# EAGLE design Logoi (EAGLE 9.6.2)
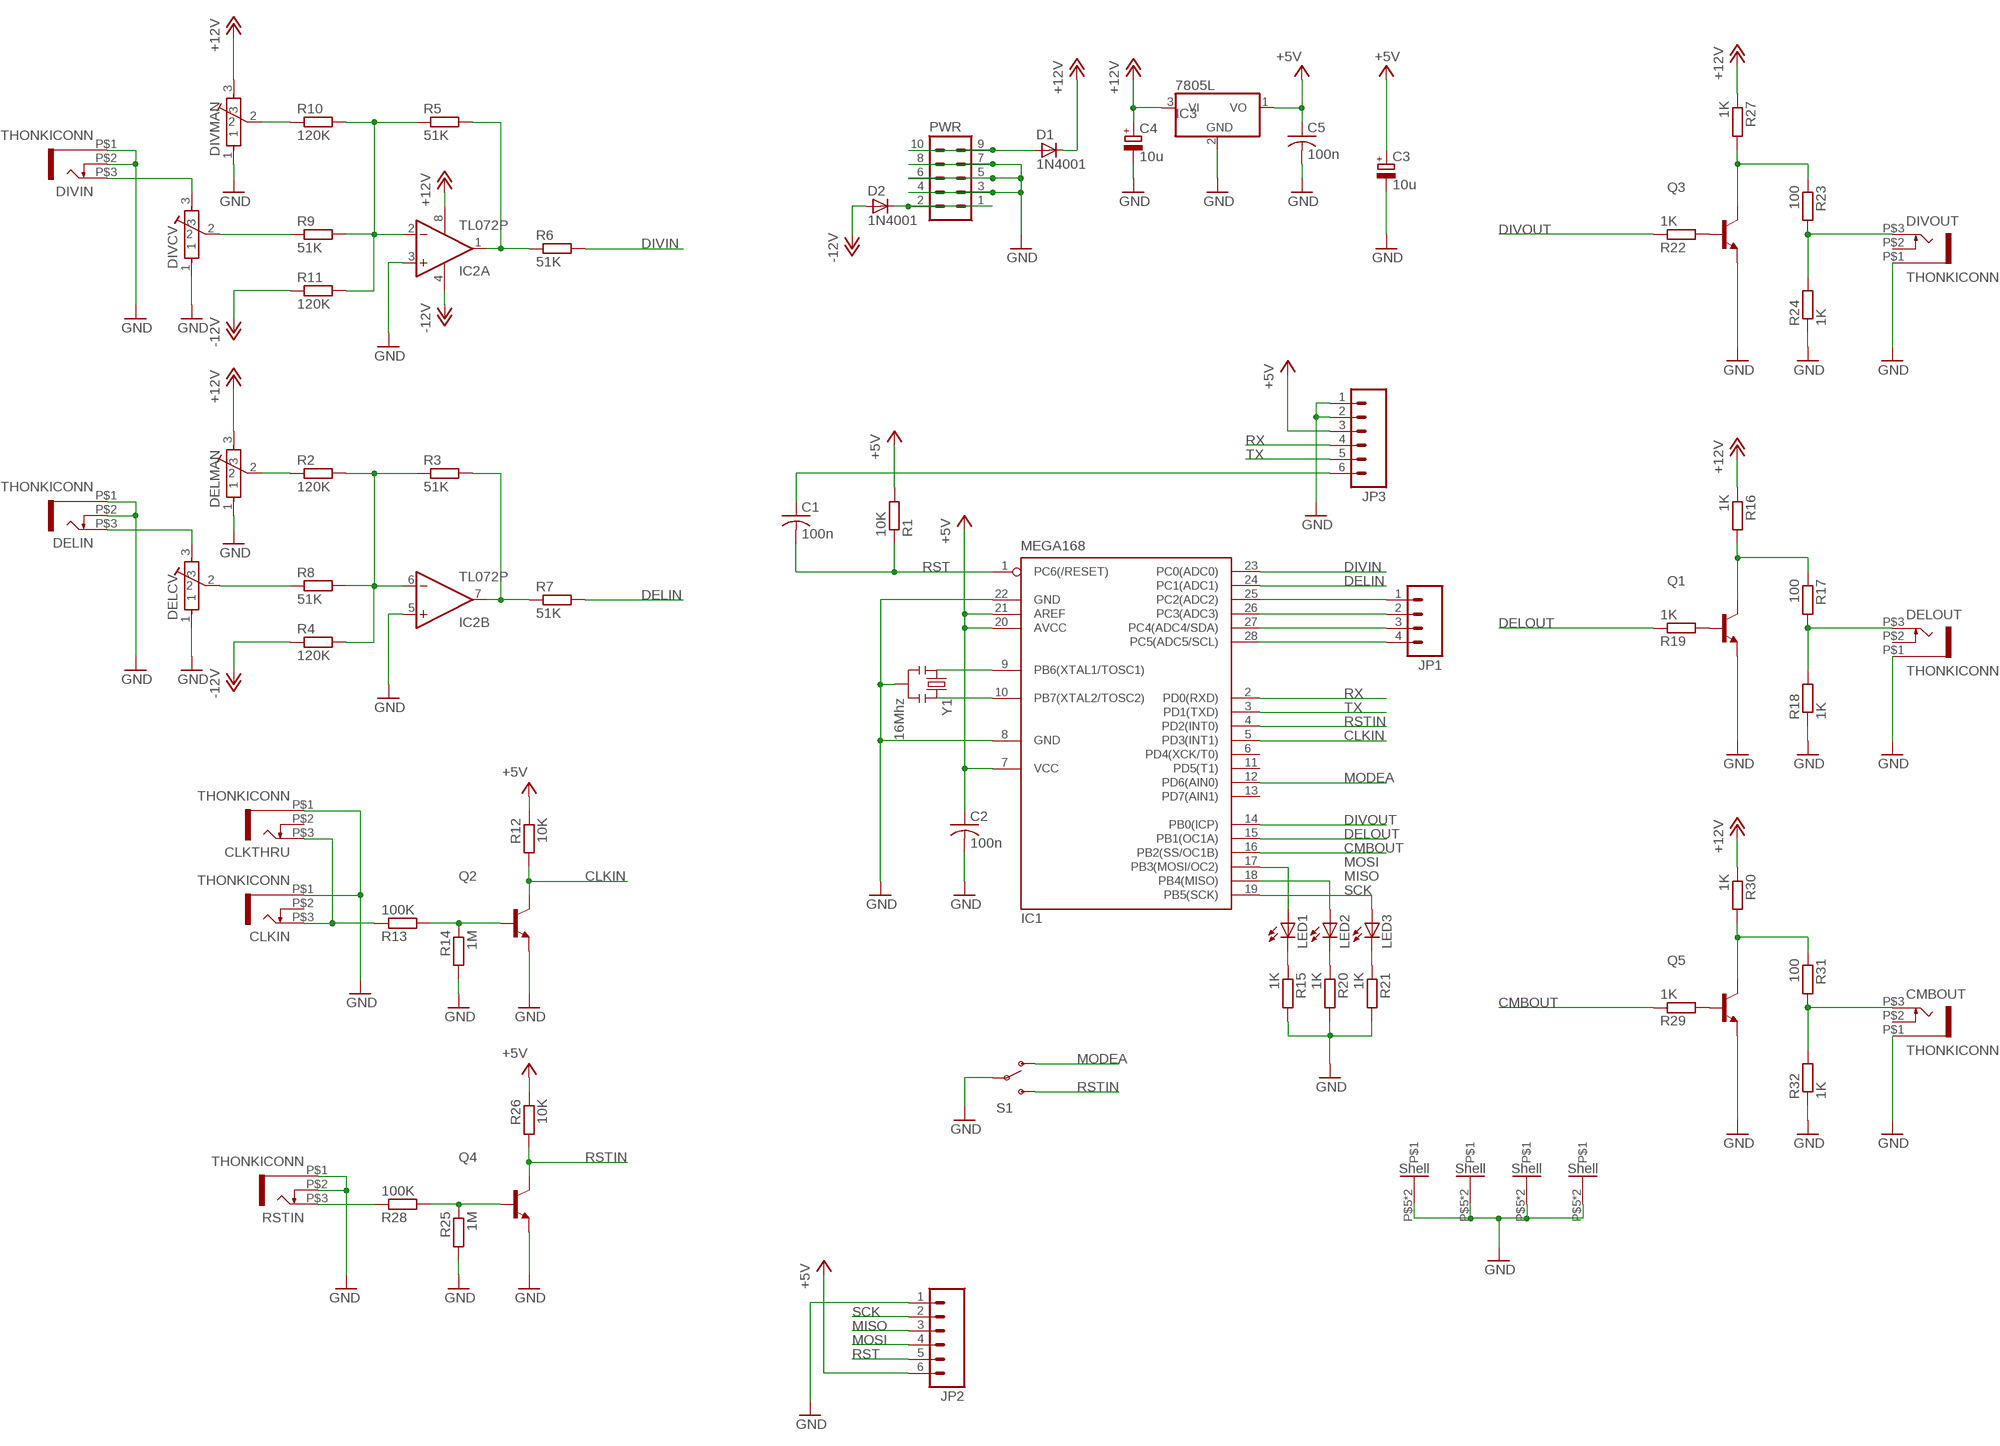
[diagram p0: schematic, sheet 1]

## Parts
C1  100n  C-US050-024X044  [C050-024X044]
C2  100n  C-US050-024X044  [C050-024X044]
C3  10u  CPOL-EUE5-6  [E5-6]
C4  10u  CPOL-EUE5-6  [E5-6]
C5  100n  C-US050-024X044  [C050-024X044]
CLKIN  THONKICONN  [THONKICONN]
CLKTHRU  THONKICONN  [THONKICONN]
CMBOUT  THONKICONN  [THONKICONN]
D1  1N4001  DIODE1N4001  [DIODE-1N4001]
D2  1N4001  DIODE1N4001  [DIODE-1N4001]
DELCV  POT-ALPS-RK09L1140  [POT-ALPS-RK09L1140]
DELIN  THONKICONN  [THONKICONN]
DELMAN  POT-ALPS-RK09L1140  [POT-ALPS-RK09L1140]
DELOUT  THONKICONN  [THONKICONN]
DIVCV  POT-ALPS-RK09L1140  [POT-ALPS-RK09L1140]
DIVIN  THONKICONN  [THONKICONN]
DIVMAN  POT-ALPS-RK09L1140  [POT-ALPS-RK09L1140]
DIVOUT  THONKICONN  [THONKICONN]
IC1  MEGA168  MEGA8-P  [DIL28-3]
IC2  TL072P  [DIL08]
IC3  7805L  [TO92]
JP1  M04PTH  [1X04]
JP2  M06SIP  [1X06]
JP3  M06SIP  [1X06]
LED1  LED3MM  [LED3MM]
LED2  LED3MM  [LED3MM]
LED3  LED3MM  [LED3MM]
PWR  MA05-2  [MA05-2]
Q1  2N3904-NPN-TO92-EBC  [TO92-EBC]
Q2  2N3904-NPN-TO92-EBC  [TO92-EBC]
Q3  2N3904-NPN-TO92-EBC  [TO92-EBC]
Q4  2N3904-NPN-TO92-EBC  [TO92-EBC]
Q5  2N3904-NPN-TO92-EBC  [TO92-EBC]
R1  10K  R-EU_0204/7  [0204/7]
R2  120K  R-EU_0204/7  [0204/7]
R3  51K  R-EU_0204/7  [0204/7]
R4  120K  R-EU_0204/7  [0204/7]
R5  51K  R-EU_0204/7  [0204/7]
R6  51K  R-EU_0204/7  [0204/7]
R7  51K  R-EU_0204/7  [0204/7]
R8  51K  R-EU_0204/7  [0204/7]
R9  51K  R-EU_0204/7  [0204/7]
R10  120K  R-EU_0204/7  [0204/7]
R11  120K  R-EU_0204/7  [0204/7]
R12  10K  R-EU_0204/7  [0204/7]
R13  100K  R-EU_0204/7  [0204/7]
R14  1M  R-EU_0204/7  [0204/7]
R15  1K  R-EU_0204/7  [0204/7]
R16  1K  R-EU_0204/7  [0204/7]
R17  100  R-EU_0204/7  [0204/7]
R18  1K  R-EU_0204/7  [0204/7]
R19  1K  R-EU_0204/7  [0204/7]
R20  1K  R-EU_0204/7  [0204/7]
R21  1K  R-EU_0204/7  [0204/7]
R22  1K  R-EU_0204/7  [0204/7]
R23  100  R-EU_0204/7  [0204/7]
R24  1K  R-EU_0204/7  [0204/7]
R25  1M  R-EU_0204/7  [0204/7]
R26  10K  R-EU_0204/7  [0204/7]
R27  1K  R-EU_0204/7  [0204/7]
R28  100K  R-EU_0204/7  [0204/7]
R29  1K  R-EU_0204/7  [0204/7]
R30  1K  R-EU_0204/7  [0204/7]
R31  100  R-EU_0204/7  [0204/7]
R32  1K  R-EU_0204/7  [0204/7]
RSTIN  THONKICONN  [THONKICONN]
S1  SWITCH-SPST  [SWITCH-SPDT-SALECOM-T8014]
Y1  16Mhz  RESONATORPTH  [RESONATOR-PTH]

## Nets
+5V: C2.1 C3.+ C5.1 IC1.7(VCC) IC1.20(AVCC) IC1.21(AREF) IC3.1(VO) JP2.6 JP3.3 R1.2 R12.1 R26.1
+12V: C4.+ D1.C DELMAN.3 DIVMAN.3 IC2.8(P:V+) IC3.3(VI) R16.1 R27.1 R30.1
-12V: D2.A IC2.4(P:V-) R4.1 R11.1
CLKIN: IC1.5(PD3(INT1)) Q2.C R12.2
CMBOUT: IC1.16(PB2(SS/OC1B)) R29.1
DELIN: IC1.24(PC1(ADC1)) R7.2
DELOUT: IC1.15(PB1(OC1A)) R19.1
DIVIN: IC1.23(PC0(ADC0)) R6.2
DIVOUT: IC1.14(PB0(ICP)) R22.1
GND: C2.2 C3.- C4.- C5.2 CLKIN.P$1 CLKTHRU.P$1 CMBOUT.P$1 DELCV.1 DELCV.P$5 DELCV.P$6 DELIN.P$1 DELIN.P$2 DELMAN.1 DELMAN.P$5 DELMAN.P$6 DELOUT.P$1 DIVCV.1 DIVCV.P$5 DIVCV.P$6 DIVIN.P$1 DIVIN.P$2 DIVMAN.1 DIVMAN.P$5 DIVMAN.P$6 DIVOUT.P$1 IC1.8(GND) IC1.22(GND) IC2.3(A:+IN) IC2.5(B:+IN) IC3.2(GND) JP2.1 JP3.1 JP3.2 PWR.3 PWR.4 PWR.5 PWR.6 PWR.7 PWR.8 Q1.E Q2.E Q3.E Q4.E Q5.E R14.2 R15.2 R18.1 R20.2 R21.2 R24.1 R25.2 R32.1 RSTIN.P$1 RSTIN.P$2 S1.2(P) Y1.2
MISO: IC1.18(PB4(MISO)) JP2.3 LED2.A
MODEA: IC1.12(PD6(AIN0)) S1.1(O)
MOSI: IC1.17(PB3(MOSI/OC2)) JP2.4 LED1.A
N$1: DIVCV.3 DIVIN.P$3
N$2: IC2.2(A:-IN) R5.1 R9.2 R10.2 R11.2
N$3: DIVMAN.2 R10.1
N$4: IC2.1(A:OUT) R5.2 R6.1
N$5: DIVCV.2 R9.1
N$6: D1.A PWR.9 PWR.10
N$7: IC2.6(B:-IN) R2.2 R3.1 R4.2 R8.2
N$8: DELMAN.2 R2.1
N$9: IC2.7(B:OUT) R3.2 R7.1
N$10: DELCV.2 R8.1
N$11: IC1.25(PC2(ADC2)) JP1.1
N$12: DELCV.3 DELIN.P$3
N$13: IC1.26(PC3(ADC3)) JP1.2
N$14: IC1.27(PC4(ADC4/SDA)) JP1.3
N$15: IC1.28(PC5(ADC5/SCL)) JP1.4
N$20: IC1.9(PB6(XTAL1/TOSC1)) Y1.1
N$21: IC1.10(PB7(XTAL2/TOSC2)) Y1.3
N$23: LED1.K(C) R15.1
N$24: LED2.K(C) R20.1
N$25: LED3.K(C) R21.1
N$26: Q1.B R19.2
N$27: Q2.B R13.2 R14.1
N$28: CLKIN.P$3 CLKTHRU.P$3 R13.1
N$29: C1.1 JP3.6
N$30: DELOUT.P$3 R17.2 R18.2
N$31: Q4.B R25.1 R28.2
N$32: Q1.C R16.2 R17.1
N$33: Q3.B R22.2
N$34: Q5.B R29.2
N$35: CMBOUT.P$3 R31.2 R32.2
N$36: DIVOUT.P$3 R23.2 R24.2
N$37: Q3.C R23.1 R27.2
N$38: Q5.C R30.2 R31.1
N$40: R28.1 RSTIN.P$3
N$42: D2.C PWR.1 PWR.2
RST: C1.2 IC1.1(PC6(/RESET)) JP2.5 R1.1
RSTIN: IC1.4(PD2(INT0)) Q4.C R26.2 S1.3(S)
RX: IC1.2(PD0(RXD)) JP3.4
SCK: IC1.19(PB5(SCK)) JP2.2 LED3.A
TX: IC1.3(PD1(TXD)) JP3.5
Unconnected: CLKIN.P$2 CLKTHRU.P$2 CMBOUT.P$2 DELOUT.P$2 DIVOUT.P$2 IC1.6(PD4(XCK/T0)) IC1.11(PD5(T1)) IC1.13(PD7(AIN1))

## Library data of the parts
C1 C2 C5 = rcl:C-US: CAPACITOR, American symbol
C3 C4 = rcl:CPOL-EU: POLARIZED CAPACITOR, European symbol
CLKIN CLKTHRU CMBOUT DELIN DELOUT DIVIN DIVOUT RSTIN = Rebel:THONKICONN
D1 D2 = Rebel:DIODE: Diode
DELCV DELMAN DIVCV DIVMAN = Rebel:POT-ALPS-RK09L
IC1 = atmel:MEGA8-P: MICROCONTROLLER 8 Kbytes FLASH, 1 kbytes SRAM, 512 bytes EEPROM, USART, 4-channel 10 bit ADC, 2-channel 8 bit ADC Pin compatible with Atmega48, ATMega88, ATMega168 Source: avr.lbr; OC_FARNELL: unknown; OC_NEWARK: unknown
IC2 = linear:TL072: OP AMP
IC3 = linear:78*: Positive VOLTAGE REGULATOR Source: http://cache.national.com/ds/LM/LM78L05.pdf http://www.fairchildsemi.com/ds/LM/LM7805.pdf
JP1 = SparkFun:M04: Header 4 Standard 4-pin 0.1" header. Use with straight break away headers (SKU : PRT-00116), right angle break away headers (PRT-00553), swiss pins (PRT-00743), machine pins (PRT-00117), and female headers (PRT-00115). Molex polarized connector foot print use with SKU : PRT-08231 with associated crimp pins and housings. 1MM SMD Version SKU: PRT-10208
JP2 JP3 = SparkFun:M06: Header 6 Standard 6-pin 0.1" header. Use with straight break away headers (SKU : PRT-00116), right angle break away headers (PRT-00553), swiss pins (PRT-00743), machine pins (PRT-00117), and female headers (PRT-00115). Molex polarized connector foot print use with SKU : PRT-08094 with associated crimp pins and housings. NOTES ON THE VARIANTS LOCK and LOCK_LONGPADS... This footprint was designed to help hold the alignment of a through-hole component (i.e. 6-pin header) while soldering it into place. You may notice that each hole has been shifted either up or down by 0.005 of an inch from it's more standard position (which is a perfectly straight line). This slight alteration caused the pins (the squares in the middle) to touch the edges of the holes. Because they are alternating, it causes a "brace" to hold the component in place. 0.005 has proven to be the perfect amount of "off-center" position when using our standard breakaway headers. Although looks a little odd when you look at the bare footprint, once you have a header in there, the alteration is very hard to notice. Also, if you push a header all the way into place, it is covered up entirely on the bottom side. This idea of altering the position of holes to aid alignment will be further integrated into the Sparkfun Library for other footprints. It can help hold any component with 3 or more connection pins.
LED1-LED3 = Rebel:LED: LED OSRAM: - CHIPLED LG R971, LG N971, LY N971, LG Q971, LY Q971, LO R971, LY R971 LH N974, LH R974 LS Q976, LO Q976, LY Q976 LO Q996 - Hyper CHIPLED LW Q18S LB Q993, LB Q99A, LB R99A - SideLED LS A670, LO A670, LY A670, LG A670, LP A670 LB A673, LV A673, LT A673, LW A673 LH A674 LY A675 LS A676, LA A676, LO A676, LY A676, LW A676 LS A679, LY A679, LG A679 - Hyper Micro SIDELED® LS Y876, LA Y876, LO Y876, LY Y876 LT Y87S - SmartLED LW L88C, LW L88S LB L89C, LB L89S, LG L890 LS L89K, LO L89K, LY L89K LS L896, LA L896, LO L896, LY L896 - TOPLED LS T670, LO T670, LY T670, LG T670, LP T670 LSG T670, LSP T670, LSY T670, LOP T670, LYG T670 LG T671, LOG T671, LSG T671 LB T673, LV T673, LT T673, LW T673 LH T674 LS T676, LA T676, LO T676, LY T676, LB T676, LH T676, LSB T676, LW T676 LB T67C, LV T67C, LT T67C, LS T67K, LO T67K, LY T67K, LW E67C LS E67B, LA E67B, LO E67B, LY E67B, LB E67C, LV E67C, LT E67C LW T67C LS T679, LY T679, LG T679 LS T770, LO T770, LY T770, LG T770, LP T770 LB T773, LV T773, LT T773, LW T773 LH T774 LS E675, LA E675, LY E675, LS T675 LS T776, LA T776, LO T776, LY T776, LB T776 LHGB T686 LT T68C, LB T68C - Hyper Mini TOPLED® LB M676 - Mini TOPLED Santana® LG M470 LS M47K, LO M47K, LY M47K Source: http://www.osram.convergy.de LUXEON: - LUMILED® LXK2-PW12-R00, LXK2-PW12-S00, LXK2-PW14-U00, LXK2-PW14-V00 LXK2-PM12-R00, LXK2-PM12-S00, LXK2-PM14-U00 LXK2-PE12-Q00, LXK2-PE12-R00, LXK2-PE12-S00, LXK2-PE14-T00, LXK2-PE14-U00 LXK2-PB12-K00, LXK2-PB12-L00, LXK2-PB12-M00, LXK2-PB14-N00, LXK2-PB14-P00, LXK2-PB14-Q00 LXK2-PR12-L00, LXK2-PR12-M00, LXK2-PR14-Q00, LXK2-PR14-R00 LXK2-PD12-Q00, LXK2-PD12-R00, LXK2-PD12-S00 LXK2-PH12-R00, LXK2-PH12-S00 LXK2-PL12-P00, LXK2-PL12-Q00, LXK2-PL12-R00 Source: www.luxeon.com KINGBRIGHT: KA-3528ASYC Source: www.kingbright.com
PWR = Rebel:MA05-2: PIN HEADER; OC_FARNELL: unknown; OC_NEWARK: unknown
Q1-Q5 = transistor-neu-to92:*-NPN-: NPN Transistror
R1-R32 = Rebel:R-EU_: RESISTOR, European symbol
S1 = Rebel:SWITCH-SPST: SPST Switch Simple slide switch. Spark Fun Electronics SKU : COM-00102
Y1 = SparkFun:RESONATOR: Resonator Small SMD resonator. This is the itty bitty 10/20MHz resonators with built in caps. CSTCE10M0G55 and CSTCE20M0V53. Footprint has been reviewed closely but hasn't been tested yet.

## Board
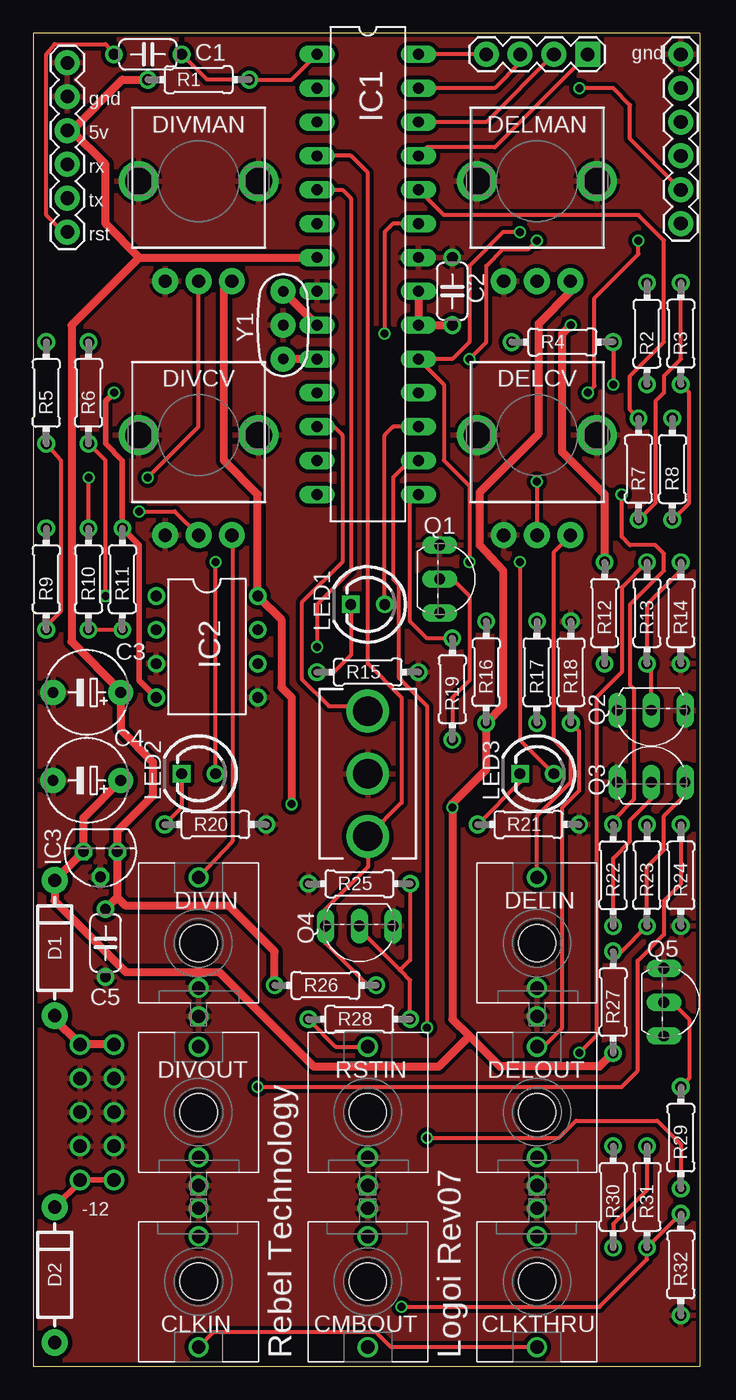
[diagram p1: board, top side]
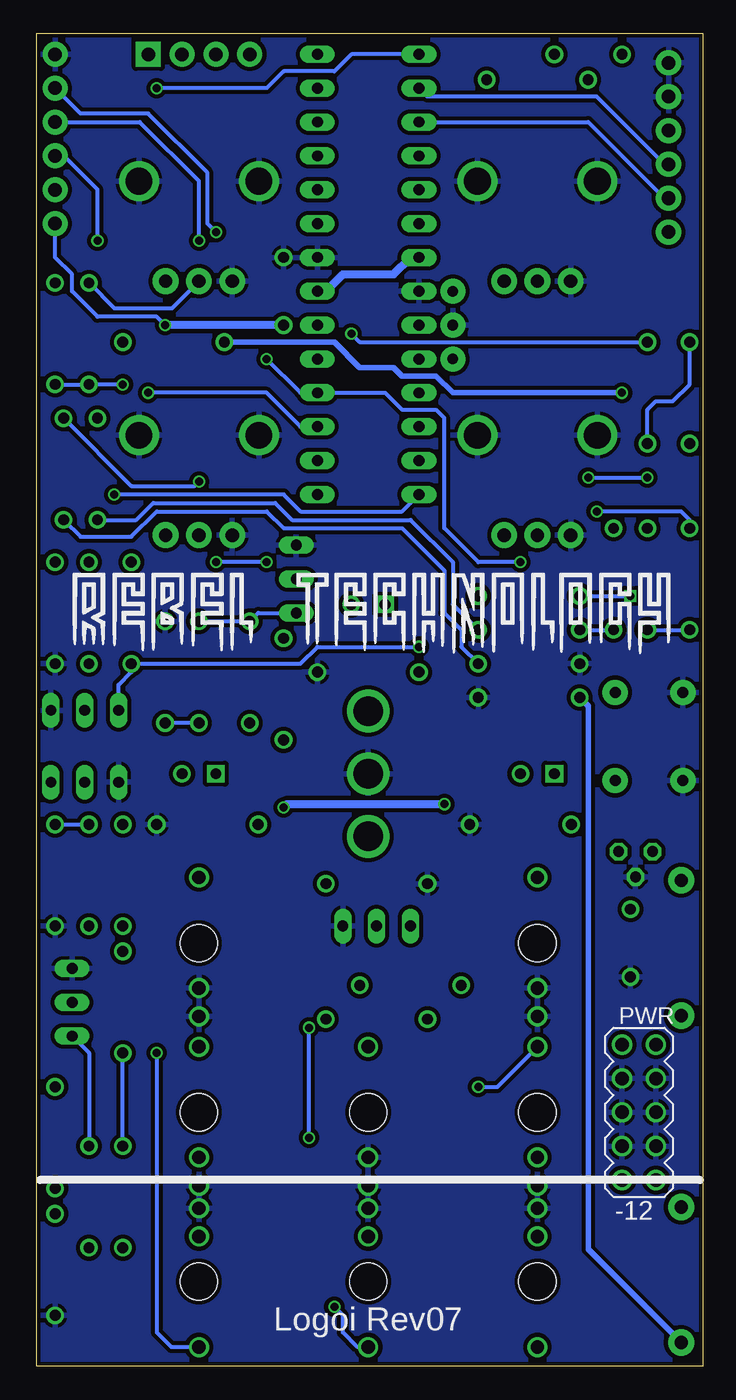
[diagram p2: board, bottom side, seen from below]

Size 50 x 100 mm. Coordinates in mm from the lower left corner, seen from the top.
Outline: 50,100 0,100 0,0 50,0 50,100
Copper layers (1*16): Top 0.035mm / dielectric 1.5mm / Bottom 0.035mm
Design rules "Fusion_eagle_rule_v1.1": minimum track width 6mil, minimum drill 12mil, track to track 6mil, track to pad 6mil, pad to pad 6mil, via to via 6mil, smd to smd 0mil, copper to edge 10mil, drill to drill 10mil, minimum pad ring 10mil, minimum via ring 6mil, stop-mask expansion 2mil, vias tented up to drill 100mil, thermal gap 10mil

### Footprints (pad centres in the part's own frame; a part is rotated, then mirrored left to right if it is on the bottom)
C050-024X044 = drill 0.813: 1 -2.54,0; 2 2.54,0
E5-6 = drill 0.813 pad 1.905: + -2.54,0; - 2.54,0
THONKICONN = drill 1: P$1 0,-5.5; P$2 0,-3.38; P$3 0,4.92 | hole 2.8: 0,0
DIODE-1N4001 = drill 1 pad 1.981: A -5.08,0; C 5.08,0
POT-ALPS-RK09L1140 = drill 1 pad 1.93: 1 -2.5,-7.5; 2 0,-7.5; 3 2.5,-7.5 | drill 2: P$5 -4.5,0; P$6 4.5,0
DIL28-3 = drill 0.813 long: 1 -16.51,-3.81; 2 -13.97,-3.81; 3 -11.43,-3.81; 4 -8.89,-3.81; 5 -6.35,-3.81; 6 -3.81,-3.81; 7 -1.27,-3.81; 8 1.27,-3.81; 9 3.81,-3.81; 10 6.35,-3.81; 11 8.89,-3.81; 12 11.43,-3.81; 13 13.97,-3.81; 14 16.51,-3.81; 15 16.51,3.81; 16 13.97,3.81; 17 11.43,3.81; 18 8.89,3.81; 19 6.35,3.81; 20 3.81,3.81; 21 1.27,3.81; 22 -1.27,3.81; 23 -3.81,3.81; 24 -6.35,3.81; 25 -8.89,3.81; 26 -11.43,3.81; 27 -13.97,3.81; 28 -16.51,3.81
DIL08 = drill 0.813 pad 1.27: 1 -3.81,-3.81; 2 -1.27,-3.81; 3 1.27,-3.81; 4 3.81,-3.81; 5 3.81,3.81; 6 1.27,3.81; 7 -1.27,3.81; 8 -3.81,3.81
TO92 = drill 0.813 octagon: 1 -1.27,0; 2 0,1.905; 3 1.27,0
1X04 = drill 1.016 pad 1.88 square: 1 0,0 | drill 1.016 pad 1.88: 2 2.54,0; 3 5.08,0; 4 7.62,0
1X06 = drill 1.016 pad 1.88: 1 0,0; 2 2.54,0; 3 5.08,0; 4 7.62,0; 5 10.16,0; 6 12.7,0
LED3MM = drill 0.813: A -1.27,0 | drill 0.813 square: K 1.27,0
MA05-2 = drill 1.016: 1 -5.08,-1.27; 2 -5.08,1.27; 3 -2.54,-1.27; 4 -2.54,1.27; 5 0,-1.27; 6 0,1.27; 7 2.54,-1.27; 8 2.54,1.27; 9 5.08,-1.27; 10 5.08,1.27
TO92-EBC = drill 0.813 long: B 0,-1.27; C 2.54,-1.27; E -2.54,-1.27
0204/7 = drill 0.813: 1 -3.81,0; 2 3.81,0
SWITCH-SPDT-SALECOM-T8014 = drill 2.2: 1 0,4.699; 2 0,0; 3 0,-4.699
RESONATOR-PTH = drill 0.8 pad 1.88: 1 -2.54,0; 2 0,0; 3 2.54,0

### Placement (x,y rotation side)
C1  8.59,98.42 0 top
C2  31.45,80.64 90 top
C3  4.02,50.55 180 top
C4  4.02,43.94 180 top
C5  5.42,31.75 270 top
CLKIN  12.4,6.35 180 top
CLKTHRU  37.8,6.35 180 top
CMBOUT  25.1,6.35 180 top
D1  1.6,31.37 90 top
D2  1.6,6.86 90 top
DELCV  37.8,69.85 0 top
DELIN  37.8,31.75 0 top
DELMAN  37.8,88.9 0 top
DELOUT  37.8,19.05 0 top
DIVCV  12.4,69.85 0 top
DIVIN  12.4,31.75 0 top
DIVMAN  12.4,88.9 0 top
DIVOUT  12.4,19.05 0 top
IC1  25.1,81.92 270 top
IC2  13.04,53.98 270 top
IC3  5.03,38.61 180 top
JP1  41.61,98.42 180 top
JP2  48.6,98.42 270 top
JP3  2.56,97.79 270 top
LED1  25.1,57.15 180 top
LED2  12.4,44.45 180 top
LED3  37.8,44.45 180 top
PWR  4.78,19.05 90 bottom
Q1  31.77,59.05 270 top
Q2  46.37,47.94 180 top
Q3  46.37,45.09 0 top
Q4  24.46,31.75 180 top
Q5  48.6,27.3 270 top
R1  12.4,96.52 180 top
R2  46.05,77.47 270 top
R3  48.6,77.47 90 top
R4  39.71,76.83 0 top
R5  0.97,73.03 90 top
R6  4.15,73.03 90 top
R7  45.42,67.31 90 top
R8  47.96,67.31 270 top
R9  0.97,59.05 270 top
R10  4.15,59.05 270 top
R11  6.69,59.05 270 top
R12  42.88,56.52 270 top
R13  46.05,56.52 270 top
R14  48.6,56.52 270 top
R15  25.1,52.07 0 top
R16  33.99,52.07 90 top
R17  37.8,52.07 270 top
R18  40.34,52.07 270 top
R19  31.45,50.8 270 top
R20  13.67,40.64 0 top
R21  37.17,40.64 0 top
R22  43.52,36.83 270 top
R23  46.05,36.83 90 top
R24  48.6,36.83 90 top
R25  24.46,36.2 180 top
R26  21.93,28.57 0 top
R27  43.52,27.3 90 top
R28  24.46,26.04 0 top
R29  48.6,17.14 90 top
R30  43.52,12.7 270 top
R31  46.05,12.7 270 top
R32  48.6,7.62 90 top
RSTIN  25.1,19.05 0 top
S1  25.1,44.45 0 top
Y1  18.75,78.11 270 top

### Tracks (layer width: path | path; a pad name or v marks a point on that pad's centre or on a via)
+5V  (via drill 0.6)
  Top 0.61: IC1.21 IC1.20 C2.1 | R12.1 42.88,65.41 39.71,68.58 39.71,77.47 v40.34,78.11 | 2.88,92.71 5.42,90.17 5.42,85.72 7.96,83.19 | JP3.3 2.88,92.71 | 2.88,92.71 6.69,96.52 R1.2 | 7.96,83.19 2.88,78.11 2.88,54.36 6.56,50.67 C3.+ 6.56,47.75 8.97,45.34 8.97,42.8 6.3,40.13 IC3.1 6.3,35.18 | 7.96,83.19 IC1.7 | R26.1 18.11,31.11 14.69,34.54 6.94,34.54 6.3,35.18 | 6.3,35.18 C5.1
  Bottom 0.305: v40.34,78.11 40.98,78.74 45.42,78.74 47.33,80.64 47.33,81.92 48.6,83.19 JP2.6
  Bottom 0.61: IC1.21 28.27,80.64 27,81.92 23.2,81.92 21.93,83.19 IC1.7 | C2.1 v40.34,78.11
+12V  (via drill 0.6)
  Top 0.61: R27.1 42.5,22.48 35.01,22.48 32.72,24.77 | 32.72,24.77 31.45,26.04 v31.45,41.91 31.45,42.23 33.99,44.77 R16.1 35.26,49.53 35.26,59.69 33.48,61.59 33.48,65.53 37.93,69.98 37.93,78.23 40.34,80.64 40.34,81.36 DELMAN.3 | v19.38,42.16 19.38,50.16 18.62,50.93 18.62,56.01 IC2.8 16.84,65.41 14.3,67.94 14.3,80.81 DIVMAN.3 | C4.+ 3.76,41.15 IC3.3 D1.C 1.6,34.92 6.95,29.58 13.93,29.58 21.04,22.48 30.43,22.48 32.72,24.77
  Bottom 0.305: R30.1 R27.1
  Bottom 0.61: v19.38,42.16 31.2,42.16 v31.45,41.91
-12V  (via drill 0.6)
  Top 0.406: IC2.4 7.96,51.44 7.96,61.59 R11.1 6.69,67.94 5.42,69.22 5.42,72.39 v6.05,73.03
  Bottom 0.406: IC2.4 8.59,49.53 8.59,8.76 D2.A | R4.1 27.64,76.83 25.73,74.93 23.2,74.93 22.56,74.3 20.02,74.3 18.75,73.03 v6.05,73.03
CLKIN  (via drill 0.6)
  Top 0.305: IC1.5 23.2,88.27 23.83,87.63 23.83,59.69 21.29,57.15 v21.29,53.98
  Bottom 0.305: v21.29,53.98 28.91,53.98 30.18,52.7 R12.2 42.88,52.07 43.83,51.12 Q2.C
CMBOUT  (via drill 0.6)
  Top 0.305: IC1.16 28.27,67.94 27,66.67 27,59.05 27.45,58.61 27.45,51.63 29.54,49.53 v29.54,25.4 | v29.54,17.14 39.45,17.14 40.72,18.41 46.82,18.41 48.6,16.64 R29.1
  Bottom 0.305: v29.54,17.14 v29.54,25.4
DELIN
  Top 0.305: IC1.24 30.81,86.36 45.42,86.36 47.33,84.45 47.33,76.83 44.79,74.3 44.79,71.75 R7.2
DELOUT
  Top 0.305: R19.1 29.54,54.61 28.27,55.88 28.27,64.77 IC1.15
DIVIN  (via drill 0.6)
  Top 0.305: IC1.23 27,85.72 26.37,85.09 v26.37,77.47
  Bottom 0.305: v26.37,77.47 25.73,76.83 R6.2
DIVOUT  (via drill 0.6)
  Top 0.305: v44.15,65.41 44.15,62.23 44.79,61.59 46.69,61.59 47.33,60.96 47.33,59.69 44.79,57.15 44.79,51.12 45.1,50.8 45.1,42.55 43.52,40.96 R22.1
  Bottom 0.305: v44.15,65.41 31.45,65.41 30.18,64.14 22.56,64.14 IC1.14
GND
  pour Bottom (isolate 0.305): 50.5,0 -0.3,0 -0.3,100.33 50.5,100.33
  pour Top (isolate 0.305): 50.5,0 -1.57,0 -1.57,100.33 50.5,100.33
MISO  (via drill 0.6)
  Top 0.305: LED2.A v13.67,60.33 | v32.72,75.56 33.99,76.83 33.99,82.55 35.26,83.82 37.17,83.82 v37.8,84.45
  Bottom 0.305: v13.67,60.33 16.84,60.33 19.38,62.87 19.38,71.12 20.02,71.75 22.56,71.75 23.83,73.03 IC1.18 30.18,73.03 v32.72,75.56 | JP2.3 42.25,93.34 37.8,88.9 v37.8,84.45
MODEA
  Top 0.305: IC1.12 22.56,70.48 23.2,69.85 23.2,60.33 20.15,57.28 20.15,51.56 22.18,49.53 24.72,49.53 S1.1
MOSI  (via drill 0.6)
  Top 0.305: IC1.17 27,70.48 26.37,69.85 LED1.A | v41.61,73.03 42.12,73.53 42.12,80.14 45.42,83.44 v45.42,84.45
  Bottom 0.305: JP2.4 47.96,90.81 45.42,88.27 v45.42,84.45 | IC1.17 30.18,70.48 32.72,73.03 v41.61,73.03
N$1
  Top 0.305: DIVCV.3 14.94,62.31 14.94,39.37 DIVIN.P$3
N$2
  Top 0.305: R5.1 2.09,67.94 2.09,56.64 0.97,55.52 R9.2 | R11.2 R10.2
  Bottom 0.305: R10.2 R9.2 | IC2.2 R11.2
N$3  (via drill 0.6)
  Top 0.305: R10.1 v4.15,66.67 | v8.59,66.67 12.4,70.48 DIVMAN.2
  Bottom 0.305: v8.59,66.67 v4.15,66.67
N$4  (via drill 0.6)
  Top 0.305: v5.42,57.78 5.42,67.94 R6.1
  Bottom 0.305: IC2.1 v5.42,57.78 | R6.1 4.15,71.75 3.51,72.39 2.24,72.39 0.97,73.66 R5.2
N$5  (via drill 0.6)
  Top 0.305: v7.96,64.14 10.61,64.14 DIVCV.2
  Bottom 0.305: R9.1 0.97,63.5 1.6,64.14 v7.96,64.14
N$6
  Top 0.61: PWR.10 PWR.9 1.6,26.04 D1.A
N$7  (via drill 0.6)
  Top 0.305: R8.2 49.23,64.77 49.23,73.03 R3.1 | R4.2 v43.52,73.66
  Bottom 0.305: R8.2 46.69,62.23 42.88,62.23 40.98,64.14 32.72,64.14 31.45,62.87 22.56,62.87 19.38,59.69 19.38,56.52 18.11,55.24 18.11,53.98 IC2.6 | R3.1 R2.2 v43.52,73.66
N$8
  Bottom 0.305: R2.1 44.15,79.38 39.83,79.38 DELMAN.2
N$9
  Top 0.305: R7.1 46.69,64.77 46.69,72.39 47.33,73.03 47.33,74.3 48.6,75.56 R3.2
  Bottom 0.305: R7.1 42.5,63.5 41.23,64.77 32.09,64.77 30.81,63.5 21.93,63.5 18.75,60.33 18.75,57.15 IC2.7
N$10  (via drill 0.6)
  Top 0.305: v37.8,66.36 DELCV.2
  Bottom 0.305: R8.1 42.88,66.04 38.12,66.04 v37.8,66.36
N$11
  Top 0.305: JP1.1 34.62,91.44 29.54,91.44 IC1.25
N$12
  Top 0.305: DELCV.3 40.32,62.33 39.07,61.09 39.07,46.99 40.34,45.72 40.34,43.81 37.8,41.27 DELIN.P$3
N$13
  Top 0.305: JP1.2 33.99,93.34 IC1.26
N$14
  Top 0.305: JP1.3 36.53,97.79 34.62,95.89 IC1.27
N$15
  Top 0.305: JP1.4 IC1.28
N$20
  Top 0.61: IC1.9 Y1.1
N$21
  Top 0.61: IC1.10 Y1.3
N$23
  Top 0.305: LED1.K 23.83,53.34 22.56,52.07 R15.1
N$24
  Top 0.305: LED2.K 11.13,41.91 R20.1
N$25
  Top 0.305: LED3.K 36.53,43.81 R21.1
N$26
  Top 0.305: Q1.B 31.45,59.05 32.72,57.78 32.72,51.44 31.45,50.16 R19.2
N$27
  Top 0.305: R14.1 48.6,59.69 46.05,57.15 R13.2 46.37,52.39 Q2.B
N$28  (via drill 0.6)
  Top 0.305: R13.1 44.15,58.42 44.15,52.07 42.25,50.16 42.25,24.77 v40.98,23.5 | CLKTHRU.P$3 26.84,1.43 25.73,2.54 13.51,2.54 CLKIN.P$3
  Bottom 0.305: v40.98,23.5 40.98,2.54 39.87,1.43 CLKTHRU.P$3
N$29
  Top 0.305: JP3.6 2.24,85.09 0.97,86.36 0.97,98.42 1.6,99.19 5.42,99.19 C1.1
N$30
  Top 0.305: DELOUT.P$3 38.28,23.97 39.71,25.4 39.71,41.91 40.98,43.18 40.98,47.62 R18.2
  Bottom 0.305: R17.2 R18.2
N$31
  Top 0.305: R28.2 28.27,28.96 27.51,29.72 | R25.1 28.27,30.48 27.51,29.72 | Q4.B 24.46,32.77 27.51,29.72
N$32
  Bottom 0.305: Q1.C 33.36,56.52 R16.2 R17.1
N$33
  Top 0.305: R22.2 43.52,38.1 44.79,39.37 44.79,40.96 46.37,42.55 Q3.B
N$34
  Top 0.305: Q5.B 47.96,27.3 49.23,26.04 49.23,21.59 R29.2
N$35  (via drill 0.6)
  Top 0.305: v27.64,4.45 42.5,4.45 46.05,8 R31.2 R32.2
  Bottom 0.305: CMBOUT.P$3 25.89,1.43 27,2.54 27,3.81 v27.64,4.45
N$36  (via drill 0.6)
  Top 0.305: v16.84,20.95 44.15,20.95 45.36,22.16 45.36,30.42 47.33,32.38 47.33,34.92 48.6,36.2 R24.2
  Bottom 0.305: R24.2 R23.2 | v16.84,20.95 15.41,20.95 DIVOUT.P$3
N$37
  Top 0.305: Q3.C 48.91,42.86 47.33,41.27 47.33,38.73 46.05,37.47 R23.1 44.15,31.11 R27.2
N$38
  Top 0.305: R31.1 46.05,13.21 43.52,10.67 R30.2
  Bottom 0.305: Q5.C 46.05,23.5 R31.1
N$40
  Top 0.305: RSTIN.P$3 22.69,23.97 20.65,26 R28.1
N$42
  Top 0.406: D2.C 3.51,13.84 PWR.1 PWR.2
RST  (via drill 0.6)
  Top 0.305: IC1.1 19.38,96.52 R1.1 13.04,96.52 C1.2 | v40.98,95.89 43.52,95.89 44.79,94.61 44.79,92.08 JP2.5
  Bottom 0.305: IC1.1 26.37,98.42 27.64,97.16 31.45,97.16 32.72,95.89 v40.98,95.89
RSTIN
  Top 0.305: IC1.4 23.83,90.81 25.1,89.53 25.1,52.7 27.64,50.16 27.64,42.29 S1.3 25.1,37.47 21.93,34.29 Q4.C 21.93,31.75 25.1,28.57 R26.2
RX
  Bottom 0.305: JP3.4 2.88,90.17 7.96,95.25 20.65,95.25 IC1.2
SCK  (via drill 0.6)
  Top 0.305: v32.72,60.33 32.72,66.04 30.81,67.94 30.81,73.66 IC1.19 31.45,75.56 32.72,76.83 32.72,82.55 35.26,85.09 v36.53,85.09 | v36.53,60.33 36.53,46.99 LED3.A
  Bottom 0.305: v32.72,60.33 v36.53,60.33 | v36.53,85.09 37.17,85.72 37.17,89.53 41.61,93.98 46.69,93.98 JP2.2
TX
  Bottom 0.305: IC1.3 8.59,93.34 2.88,87.63 JP3.5

### Text on the board
tPlace: gnd | gnd | 5v | rx | tx | rst | -12 | Rebel Technology | Logoi Rev07
bPlace: -12 | Logoi Rev07
tNames: Y1